# Altium schematic sheet Schematic.SchDoc
size A3
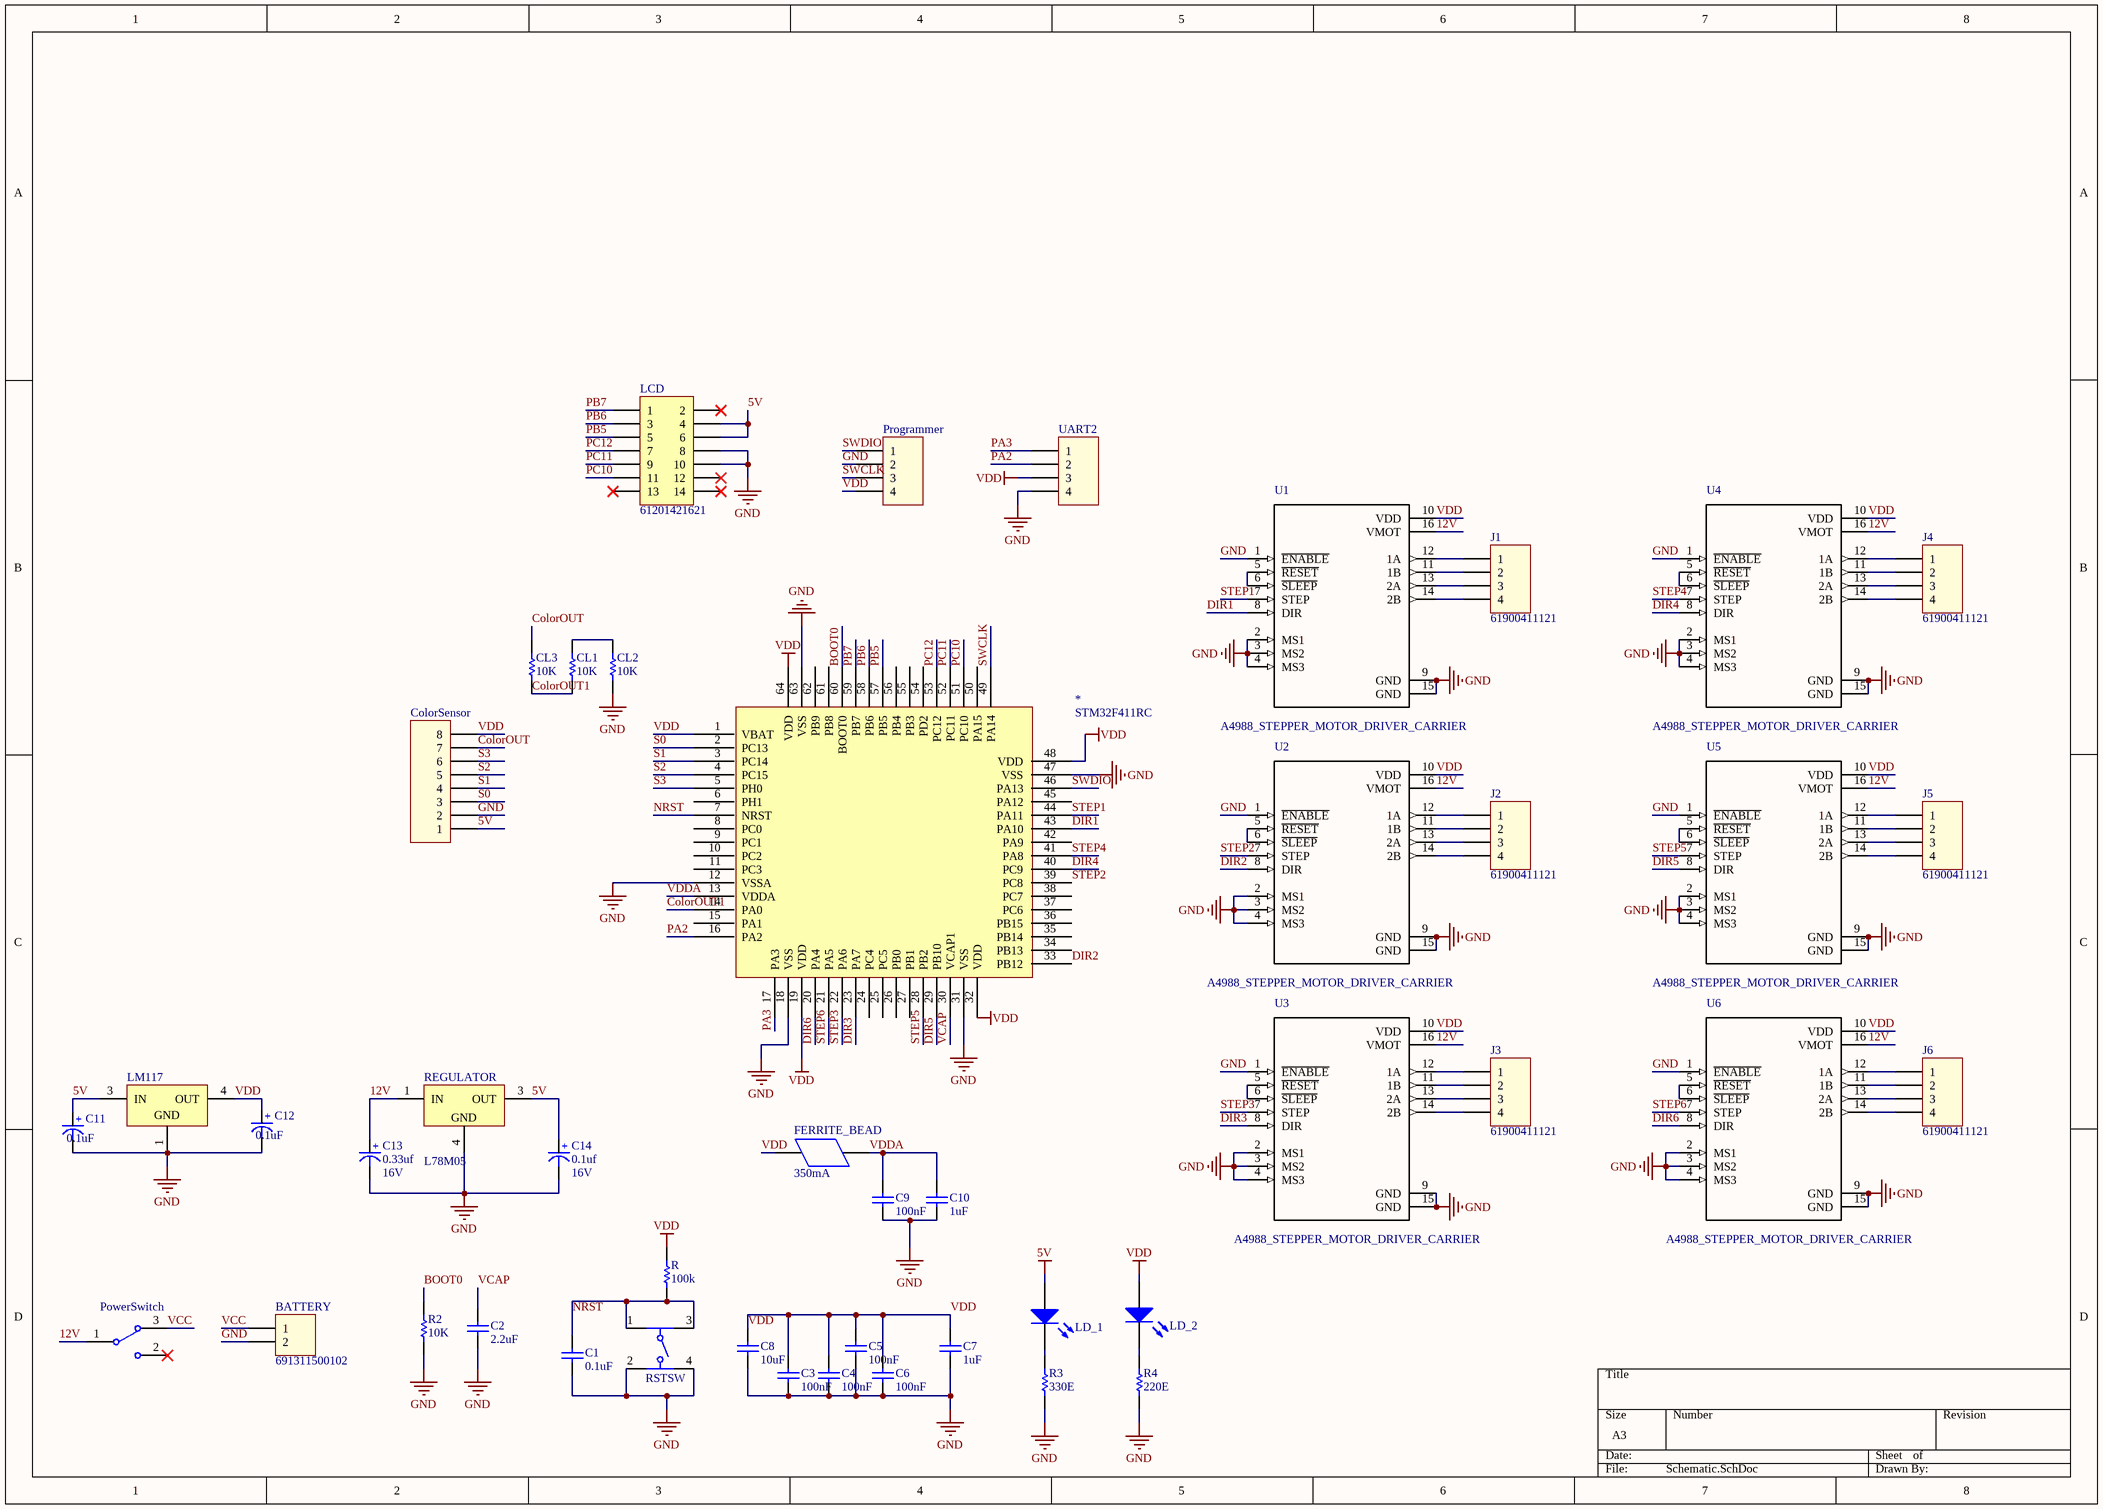
[diagram p0: Schematic.SchDoc]

## Parts
*  STM32F411RC  [STM32F411RC_]
BATTERY  691311500102  [691311500102]
C1  0.1uF  [CAPC3413X12N]
C2  2.2uF  [CAPC3413X12N]
C3  100nF  [CAPC3413X12N]
C4  100nF  [CAPC3413X12N]
C5  100nF  [CAPC3413X12N]
C6  100nF  [CAPC3413X12N]
C7  1uF  [CAPC3413X12N]
C8  10uF  [CAPC3413X12N]
C9  100nF  [CAPC3413X12N]
C10  1uF  [CAPC3413X12N]
C11  0.1uF  [cap 00]
C12  0.1uF  [cap 00]
C13  Voltage: 16V  [cap 01]  (hidden comment: 0.33uf)
C14  Voltage: 16V  [cap 01]  (hidden comment: 0.1uf)
CL1  10K  [RES0805]
CL2  10K  [RES0805]
CL3  10K  [RES0805]
ColorSensor  (no value)  [61900811121]
FERRITE_BEAD  350mA  [0805 (2012) Capacitor]
J1  61900411121  [61900411121]
J2  61900411121  [61900411121]
J3  61900411121  [61900411121]
J4  61900411121  [61900411121]
J5  61900411121  [61900411121]
J6  61900411121  [61900411121]
LCD  61201421621  [61201421621]
LD_1  SMD 1206 LED  [LED-3mm]  (value not drawn)
LD_2  SMD 1206 LED  [LED-3mm]  (value not drawn)
LM117  (no value)  [SOT223_N]
PowerSwitch  450301014042  [450301014042]  (value not drawn)
Programmer  (no value)  [61900411121]
R  100k  [RES0805]
R2  10K  [RES0805]
R3  330E  [RES0805]
R4  220E  [RES0805]
REGULATOR  L78M05  [TO-252]
RSTSW  430156050736  [4301x60507x6_6x6x5]  (value not drawn)
U1  A4988_STEPPER_MOTOR_DRIVER_CARRIER  [*MODULE_A4988_STEPPER_MOTOR_DRIVER_CARRIER]
U2  A4988_STEPPER_MOTOR_DRIVER_CARRIER  [*MODULE_A4988_STEPPER_MOTOR_DRIVER_CARRIER]
U3  A4988_STEPPER_MOTOR_DRIVER_CARRIER  [*MODULE_A4988_STEPPER_MOTOR_DRIVER_CARRIER]
U4  A4988_STEPPER_MOTOR_DRIVER_CARRIER  [*MODULE_A4988_STEPPER_MOTOR_DRIVER_CARRIER]
U5  A4988_STEPPER_MOTOR_DRIVER_CARRIER  [*MODULE_A4988_STEPPER_MOTOR_DRIVER_CARRIER]
U6  A4988_STEPPER_MOTOR_DRIVER_CARRIER  [*MODULE_A4988_STEPPER_MOTOR_DRIVER_CARRIER]
UART2  (no value)  [61900411121]

## Nets
5V: C11.1(+) C14.1(+) ColorSensor.1 LCD.4 LCD.6 LD_1.1(A) LM117.3(IN) REGULATOR.3(OUT)
GND: *.12(VSSA) *.18(VSS) *.31(VSS) *.47(VSS) *.63(VSS) BATTERY.2 C1.2 C2.2 C3.1 C4.1 C5.1 C6.1 C7.1 C8.1 C9.1 C10.1 C11.2(-) C12.2(-) C13.2(-) C14.2(-) CL2.1 ColorSensor.2 LCD.8 LCD.10 LM117.1(GND) Programmer.2 R2.1 R3.1 R4.1 REGULATOR.4(GND) RSTSW.2 RSTSW.4 U1.1(~{ENABLE}) U1.2(MS1) U1.3(MS2) U1.4(MS3) U1.9(GND) U1.15(GND) U2.1(~{ENABLE}) U2.2(MS1) U2.3(MS2) U2.4(MS3) U2.9(GND) U2.15(GND) U3.1(~{ENABLE}) U3.2(MS1) U3.3(MS2) U3.4(MS3) U3.9(GND) U3.15(GND) U4.1(~{ENABLE}) U4.2(MS1) U4.3(MS2) U4.4(MS3) U4.9(GND) U4.15(GND) U5.1(~{ENABLE}) U5.2(MS1) U5.3(MS2) U5.4(MS3) U5.9(GND) U5.15(GND) U6.1(~{ENABLE}) U6.2(MS1) U6.3(MS2) U6.4(MS3) U6.9(GND) U6.15(GND) UART2.4
VDD: *.1(VBAT) *.19(VDD) *.32(VDD) *.48(VDD) *.64(VDD) C3.2 C4.2 C5.2 C6.2 C7.2 C8.2 C12.1(+) ColorSensor.8 FERRITE_BEAD.2 LD_2.1(A) LM117.4(OUT) Programmer.4 R.2 U1.10(VDD) U2.10(VDD) U3.10(VDD) U4.10(VDD) U5.10(VDD) U6.10(VDD) UART2.3
12V: C13.1(+) PowerSwitch.1(COM) REGULATOR.1(IN) U1.16(VMOT) U2.16(VMOT) U3.16(VMOT) U4.16(VMOT) U5.16(VMOT) U6.16(VMOT)
BOOT0: *.60(BOOT0) R2.2
ColorOUT: CL3.2 ColorSensor.7
ColorOUT1: *.14(PA0) CL1.1 CL3.1
DIR1: *.43(PA10) U1.8(DIR)
DIR2: *.33(PB12) U2.8(DIR)
DIR3: *.23(PA7) U3.8(DIR)
DIR4: *.40(PC9) U4.8(DIR)
DIR5: *.29(PB10) U5.8(DIR)
DIR6: *.20(PA4) U6.8(DIR)
NRST: *.7(NRST) C1.1 R.1 RSTSW.1 RSTSW.3
PA2: *.16(PA2) UART2.2
PA3: *.17(PA3) UART2.1
PB5: *.57(PB5) LCD.5
PB6: *.58(PB6) LCD.3
PB7: *.59(PB7) LCD.1
PC10: *.51(PC10) LCD.11
PC11: *.52(PC11) LCD.9
PC12: *.53(PC12) LCD.7
S0: *.2(PC13) ColorSensor.3
S1: *.3(PC14) ColorSensor.4
S2: *.4(PC15) ColorSensor.5
S3: *.5(PH0) ColorSensor.6
STEP1: *.44(PA11) U1.7(STEP)
STEP2: *.39(PC8) U2.7(STEP)
STEP3: *.22(PA6) U3.7(STEP)
STEP4: *.41(PA8) U4.7(STEP)
STEP5: *.28(PB2) U5.7(STEP)
STEP6: *.21(PA5) U6.7(STEP)
SWCLK: *.49(PA14) Programmer.3
SWDIO: *.46(PA13) Programmer.1
VCAP: *.30(VCAP1) C2.1
VCC: BATTERY.1 PowerSwitch.3
VDDA: *.13(VDDA) C9.2 C10.2 FERRITE_BEAD.1
NetCL1_2: CL1.2 CL2.2
NetJ1_1: J1.1 U1.12(1A)
NetJ1_2: J1.2 U1.11(1B)
NetJ1_3: J1.3 U1.13(2A)
NetJ1_4: J1.4 U1.14(2B)
NetJ2_1: J2.1 U2.12(1A)
NetJ2_2: J2.2 U2.11(1B)
NetJ2_3: J2.3 U2.13(2A)
NetJ2_4: J2.4 U2.14(2B)
NetJ3_1: J3.1 U3.12(1A)
NetJ3_2: J3.2 U3.11(1B)
NetJ3_3: J3.3 U3.13(2A)
NetJ3_4: J3.4 U3.14(2B)
NetJ4_1: J4.1 U4.12(1A)
NetJ4_2: J4.2 U4.11(1B)
NetJ4_3: J4.3 U4.13(2A)
NetJ4_4: J4.4 U4.14(2B)
NetJ5_1: J5.1 U5.12(1A)
NetJ5_2: J5.2 U5.11(1B)
NetJ5_3: J5.3 U5.13(2A)
NetJ5_4: J5.4 U5.14(2B)
NetJ6_1: J6.1 U6.12(1A)
NetJ6_2: J6.2 U6.11(1B)
NetJ6_3: J6.3 U6.13(2A)
NetJ6_4: J6.4 U6.14(2B)
NetLD_1_2: LD_1.2(K) R3.2
NetLD_2_2: LD_2.2(K) R4.2
NetU1_5: U1.5(~{RESET}) U1.6(~{SLEEP})
NetU2_5: U2.5(~{RESET}) U2.6(~{SLEEP})
NetU3_5: U3.5(~{RESET}) U3.6(~{SLEEP})
NetU4_5: U4.5(~{RESET}) U4.6(~{SLEEP})
NetU5_5: U5.5(~{RESET}) U5.6(~{SLEEP})
NetU6_5: U6.5(~{RESET}) U6.6(~{SLEEP})

Not connected (* = marked no-connect by the designer): * 6(PH1) 8(PC0) 9(PC1) 10(PC2) 11(PC3) 15(PA1) 24(PC4) 25(PC5) 26(PB0) 27(PB1) 34(PB13) 35(PB14) 36(PB15) 37(PC6) 38(PC7) 42(PA9) 45(PA12) 50(PA15) 54(PD2) 55(PB3) 56(PB4) 61(PB8) 62(PB9); LCD 2* 12* 13* 14*; PowerSwitch 2*

## Library data of the parts
BATTERY = 691311500102: WR-TBL Serie 311 - 5.08 mm Close Vertical PCB Header, 02p; Pitch: 5.08 mm; ComponentLink1Description: Manufacturer; ComponentLink1URL: http://www.we-online.de; ComponentLink2Description: Datasheet; ComponentLink2URL: http://katalog.we-online.de/em/datasheet/6913115001xx.pdf; Part Number: 691311500102; Published Date: Feb. 2017; Publisher: Wurth Elektronik; Pin Number: 02p
C1-C10 = CAP SMD 0805: CAP 0805; Designer: Abbas Basereh; Desc.: CAP SMD 0805; Data: 16-12-2016
C11-C14 = CAP_Polar: Polar Capacitor; Designer: Eng. Saeid Jorablo; Company: SJ Libraries; ComponentLink1Description: Datasheet; ComponentLink2Description: Reference; Publisher: SJ Unlimited; Mounting Technology: Surface Mount\Through-Hole; HelpURL: http://s3.picofile.com/file/7443264187/Coming_Soon_logo.gif; Status: Unreleased
  C13: Value: 0.33uf
  C14: Value: 0.1uf
CL1-CL3 R R2-R4 = RES SMD PACKAGE: TOTAL SMD RESISTOR PACK; Designer: Abbas Basereh; Desc.: RES SMD PAKAGES; Data: 2017-3-10
ColorSensor = 61900811121: WR-WTB 2.54mm Male Locking Header, 8p; Pin Number: 8; ComponentLink1Description: Manufacturer; ComponentLink1URL: http://www.we-online.de; ComponentLink2Description: Datasheet; ComponentLink2URL: http://katalog.we-online.de/em/datasheet/6190xx11121.pdf; Part Number: 61900811121; Published Date: June 2017; Publisher: Wurth Elektronik; Pitch: 2.54 mm
FERRITE_BEAD = Ferrite Beads
J1-J6 Programmer UART2 = 61900411121: WR-WTB 2.54mm Male Locking Header, 4p; Pin Number: 4; ComponentLink1Description: Manufacturer; ComponentLink1URL: http://www.we-online.de; ComponentLink2Description: Datasheet; ComponentLink2URL: http://katalog.we-online.de/em/datasheet/6190xx11121.pdf; Part Number: 61900411121; Published Date: June 2017; Publisher: Wurth Elektronik; Pitch: 2.54 mm
LCD = 61201421621: WR-BHD 2.54mm Male Box Header; Manufacturer: Wurth Elektronik; ComponentLink1 Description: Manufacturer; ComponentLink2 Description: Datasheet; NoPins: 14; Created Date: March 2016; partNo: 61201421621; ComponentLink1URL: http://www.we-online.com; ComponentLink2URL: http://katalog.we-online.de/em/datasheet/6120xx21621.pdf; Created by: Baojun Chen
LD_1 LD_2 = LED 3mm: Typical LED
LM117 = LM1117DT-1.8: x.x Volt, 800mA Low-Dropout Linear Regulator, 3-pin TO-252; PartNumber: LM1117DT-3.3; Manufacturer: National Semiconductor; PackageTopMarking: NSUZXYTT*LM1117*DT-X.X; PowerWise: N; CompType: LDO IC; DatasheetVersion: Apr-2006; PackageVersion: revD, Feb-2009; PackageReference: TD03B; PackageDescription: TO252, Molded, Jedec, 6.8 x 6.10 x 2.30mm Body, 3 Lead, 2.28mm Pitch, Surface Mount; Supplier 1: Farnell; Supplier 2: Farnell; RoHS: N; PinCount: 3; Code_JEDEC: TO-252-AA; ComponentLink1Description: LM1117 Datasheet; ComponentLink1URL: http://www.national.com/ds/LM/LM1117.pdf; ComponentLink2Description: LM1117 Web Page; ComponentLink2URL: http://www.national.com/pf/LM/LM1117.html; ComponentLink3Description: TD03B Package Page; ComponentLink3URL: http://www.national.com/packaging/folders/td03b.html
PowerSwitch = 450301014042: WS-SLTV 10x2.5 mm THT; ComponentLink1Description: Manufacturer; ComponentLink1URL: http://www.we-online.de; ComponentLink2Description: Datasheet; ComponentLink2URL: http://katalog.we-online.de/em/datasheet/450301014042.pdf; Part Number: 450301014042; Published Date: June 2017; Publisher: Wurth Elektronik
REGULATOR = L78M05: Precision 500mA Regulator
RSTSW = 430156050736: WS-TATV 6x6mm Tact Switch, THT version; Operation Force: 360g; ComponentLink1Description: Manufacturer; ComponentLink1URL: http://www.we-online.de; ComponentLink2Description: Datasheet; ComponentLink2URL: http://katalog.we-online.de/em/datasheet/4301x6xxx7x6.pdf; Part Number: 430156050736; Published Date: June 2017; Publisher: Wurth Elektronik; Size: 6x6x5 mm; Life Cycle: 200000 cycles
U1-U6 = A4988_STEPPER_MOTOR_DRIVER_CARRIER: Stepper Motor Driver; MF: Pololu; MP: A4988 STEPPER MOTOR DRIVER CARRIER; Availability: Unavailable; Package: None; SnapEDA_Link: https://www.snapeda.com/parts/A4988%20STEPPER%20MOTOR%20DRIVER%20CARRIER/Pololu/view-part/1499394/?ref=snap; Price: None; Value: *